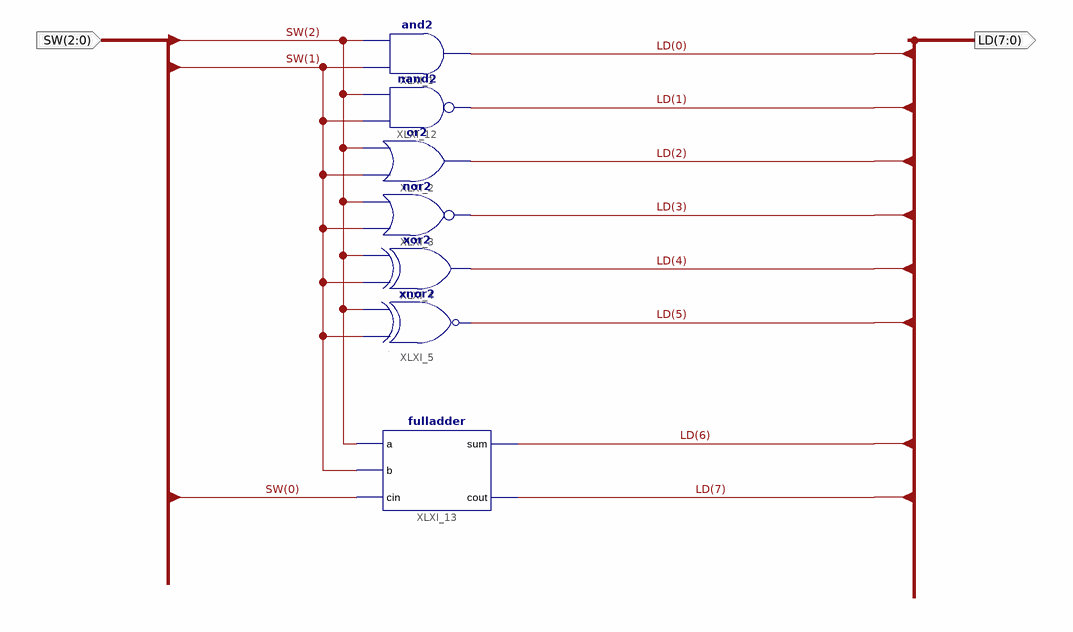
[diagram p0: schematic sheet 1]
// Xilinx ISE schematic schema.sch (spartan3e) as structural Verilog: 7 symbols, 2 ports
module schema (
  input  [2:0] SW,
  output [7:0] LD
);

  and XLXI_1 (LD[0], SW[1], SW[2]);
  or XLXI_2 (LD[2], SW[1], SW[2]);
  nor XLXI_3 (LD[3], SW[1], SW[2]);
  xor XLXI_4 (LD[4], SW[1], SW[2]);
  xnor XLXI_5 (LD[5], SW[1], SW[2]);
  nand XLXI_12 (LD[1], SW[1], SW[2]);
  fulladder XLXI_13 (.a(SW[2]), .b(SW[1]), .cin(SW[0]), .sum(LD[6]), .cout(LD[7]));
endmodule
